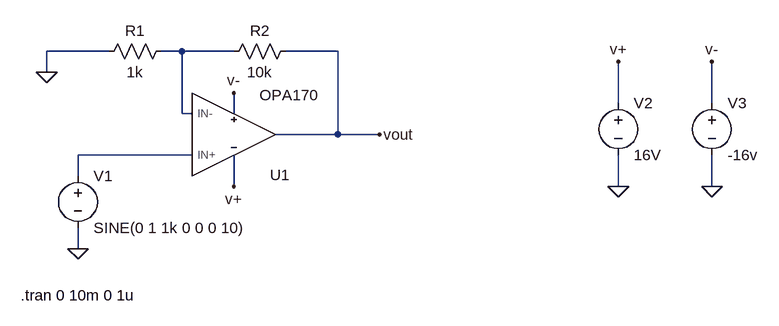
[diagram p0: schematic opa170_test.asc]
opa170_test.asc, the LTspice schematic file:
Version 4
SHEET 1 1068 680
WIRE 64 64 -32 64
WIRE 176 64 144 64
WIRE 256 64 176 64
WIRE 416 64 336 64
WIRE -32 96 -32 64
WIRE 848 144 848 80
WIRE 992 144 992 80
WIRE 176 160 176 64
WIRE 192 160 176 160
WIRE 256 160 256 128
WIRE 416 192 416 64
WIRE 416 192 320 192
WIRE 480 192 416 192
WIRE 192 224 16 224
WIRE 16 256 16 224
WIRE 256 272 256 224
WIRE 848 272 848 224
WIRE 992 272 992 224
WIRE 16 368 16 336
FLAG 16 368 0
FLAG -32 96 0
FLAG 848 272 0
FLAG 992 272 0
FLAG 848 80 v+
FLAG 992 80 v-
FLAG 256 272 v+
FLAG 256 128 v-
FLAG 480 192 vout
SYMBOL res 160 48 R90
WINDOW 0 0 56 VBottom 2
WINDOW 3 32 56 VTop 2
SYMATTR InstName R1
SYMATTR Value 1k
SYMBOL res 352 48 R90
WINDOW 0 0 56 VBottom 2
WINDOW 3 32 56 VTop 2
SYMATTR InstName R2
SYMATTR Value 10k
SYMBOL voltage 16 240 R0
WINDOW 123 0 0 Left 2
WINDOW 39 0 0 Left 2
SYMATTR InstName V1
SYMATTR Value SINE(0 1 1k 0 0 0 10)
SYMBOL voltage 848 128 R0
WINDOW 123 0 0 Left 2
WINDOW 39 0 0 Left 2
SYMATTR InstName V2
SYMATTR Value 16V
SYMBOL voltage 992 128 R0
WINDOW 123 0 0 Left 2
WINDOW 39 0 0 Left 2
SYMATTR InstName V3
SYMATTR Value -16v
SYMBOL opa170 256 192 M180
SYMATTR InstName U1
TEXT -72 440 Left 2 !.tran 0 10m 0 1u

The netlist it stands for:
* opa170_test.asc
R1 N001 0 1k
R2 vout N001 10k
V1 N002 0 SINE(0 1 1k 0 0 0 10)
V2 v+ 0 16V
V3 v- 0 -16v
XU1 N002 N001 v- v+ vout OPA170  ; pins IN+ IN- VCC VEE OUT
.tran 0 10m 0 1u
.lib OPA170.lib
.backanno
.end